# Altium project 840-00175revA - CBL ASSY, Sinsitro Camera Controller Extension.PrjPcb
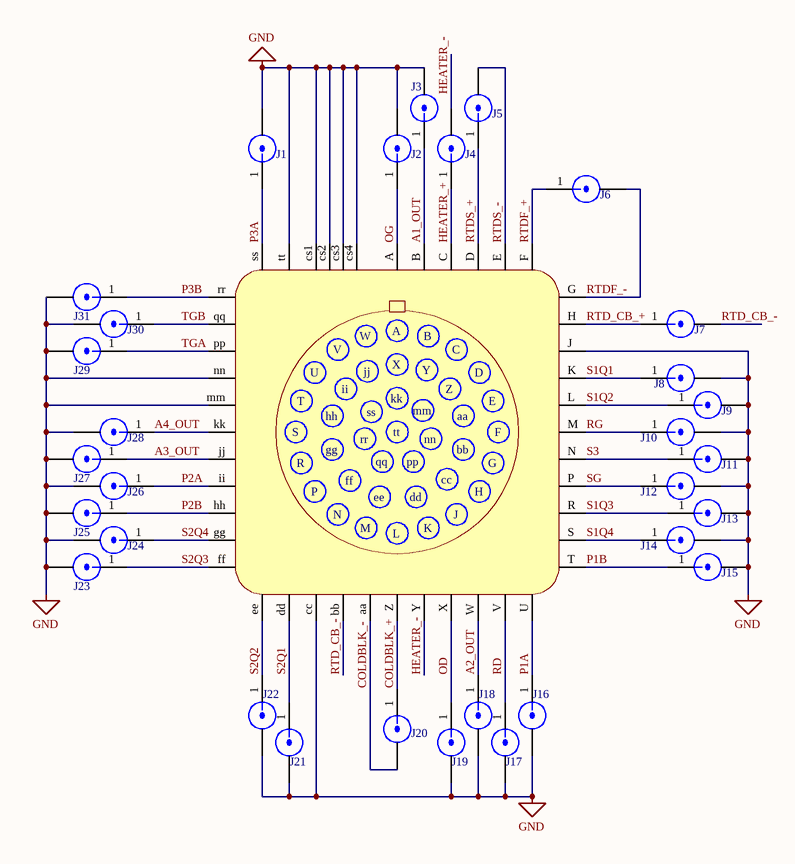
[diagram p0: 780-00059revA - SCH, Sinistro Camera Controller Extension.SchDoc]
1 sheet, 32 parts. Net scope: global (net labels, ports and power ports of the same name join across sheets).
Board file: 175-00065revA - PCB, Sinistro Camera Controller Extension.PcbDoc

## Sheet 780-00059revA - SCH, Sinistro Camera Controller Extension.SchDoc
size B; Organization: Altium Limited; Address1: L3, 12a Rodborough Rd; Address2: Frenchs Forest; Address3: NSW; Address4: Australia 2086

### Parts
J1  RG-178_CoaxTermination  [RG-178_TERMINATION]  (value not drawn)
J2  RG-178_CoaxTermination  [RG-178_TERMINATION]  (value not drawn)
J3  RG-178_CoaxTermination  [RG-178_TERMINATION]  (value not drawn)
J4  RG-178_CoaxTermination  [RG-178_TERMINATION]  (value not drawn)
J5  RG-178_CoaxTermination  [RG-178_TERMINATION]  (value not drawn)
J6  RG-178_CoaxTermination  [RG-178_TERMINATION]  (value not drawn)
J7  RG-178_CoaxTermination  [RG-178_TERMINATION]  (value not drawn)
J8  RG-178_CoaxTermination  [RG-178_TERMINATION]  (value not drawn)
J9  RG-178_CoaxTermination  [RG-178_TERMINATION]  (value not drawn)
J10  RG-178_CoaxTermination  [RG-178_TERMINATION]  (value not drawn)
J11  RG-178_CoaxTermination  [RG-178_TERMINATION]  (value not drawn)
J12  RG-178_CoaxTermination  [RG-178_TERMINATION]  (value not drawn)
J13  RG-178_CoaxTermination  [RG-178_TERMINATION]  (value not drawn)
J14  RG-178_CoaxTermination  [RG-178_TERMINATION]  (value not drawn)
J15  RG-178_CoaxTermination  [RG-178_TERMINATION]  (value not drawn)
J16  RG-178_CoaxTermination  [RG-178_TERMINATION]  (value not drawn)
J17  RG-178_CoaxTermination  [RG-178_TERMINATION]  (value not drawn)
J18  RG-178_CoaxTermination  [RG-178_TERMINATION]  (value not drawn)
J19  RG-178_CoaxTermination  [RG-178_TERMINATION]  (value not drawn)
J20  RG-178_CoaxTermination  [RG-178_TERMINATION]  (value not drawn)
J21  RG-178_CoaxTermination  [RG-178_TERMINATION]  (value not drawn)
J22  RG-178_CoaxTermination  [RG-178_TERMINATION]  (value not drawn)
J23  RG-178_CoaxTermination  [RG-178_TERMINATION]  (value not drawn)
J24  RG-178_CoaxTermination  [RG-178_TERMINATION]  (value not drawn)
J25  RG-178_CoaxTermination  [RG-178_TERMINATION]  (value not drawn)
J26  RG-178_CoaxTermination  [RG-178_TERMINATION]  (value not drawn)
J27  RG-178_CoaxTermination  [RG-178_TERMINATION]  (value not drawn)
J28  RG-178_CoaxTermination  [RG-178_TERMINATION]  (value not drawn)
J29  RG-178_CoaxTermination  [RG-178_TERMINATION]  (value not drawn)
J30  RG-178_CoaxTermination  [RG-178_TERMINATION]  (value not drawn)
J31  RG-178_CoaxTermination  [RG-178_TERMINATION]  (value not drawn)
P1  125-00409 - MIL-DTL-26482 20-41 Pins, Jam nut  [MS-3116 Size 20-41, Male]  (value not drawn)

### Nets
GND: J1.GND J2.GND J3.GND J8.GND J9.GND J10.GND J11.GND J12.GND J13.GND J14.GND J15.GND J16.GND J17.GND J18.GND J19.GND J21.GND J22.GND J23.GND J24.GND J25.GND J26.GND J27.GND J28.GND J29.GND J30.GND J31.GND P1.cc P1.cs1 P1.cs2 P1.cs3 P1.cs4 P1.J P1.mm P1.nn P1.tt
A1_OUT: J3.1 P1.B
A2_OUT: J18.1 P1.W
A3_OUT: J27.1 P1.jj
A4_OUT: J28.1 P1.kk
COLDBLK_+: J20.1 P1.Z
COLDBLK_-: J20.GND P1.aa
HEATER_+: J4.1 P1.C
HEATER_-: J4.GND P1.Y
OD: J19.1 P1.X
OG: J2.1 P1.A
P1A: J16.1 P1.U
P1B: J15.1 P1.T
P2A: J26.1 P1.ii
P2B: J25.1 P1.hh
P3A: J1.1 P1.ss
P3B: J31.1 P1.rr
RD: J17.1 P1.V
RG: J10.1 P1.M
RTD_CB_+: J7.1 P1.H
RTD_CB_-: J7.GND P1.bb
RTDF_+: J6.1 P1.F
RTDF_-: J6.GND P1.G
RTDS_+: J5.1 P1.D
RTDS_-: J5.GND P1.E
S1Q1: J8.1 P1.K
S1Q2: J9.1 P1.L
S1Q3: J13.1 P1.R
S1Q4: J14.1 P1.S
S2Q1: J21.1 P1.dd
S2Q2: J22.1 P1.ee
S2Q3: J23.1 P1.ff
S2Q4: J24.1 P1.gg
S3: J11.1 P1.N
SG: J12.1 P1.P
TGA: J29.1 P1.pp
TGB: J30.1 P1.qq

### Notes on the sheet
- Title
- Size:
- Date:
- B
- Number:
- Time:
- Revision:
- Sheet
- of
- File:

### Library data of the parts
J1 = RG-178_CoaxTermination: Coax termination